# Altium schematic sheet NuPrism_MCPMT - ADC and Amplifier ADA4945-1 - Rev2.SchDoc: NuPrism Multichannel PMT - ADC and Amplifier ADA4945-1
size A; DrawnBy: D.Bishop; DocumentNumber: 9; Revision: 2; SheetNumber: 9; SheetTotal: 20
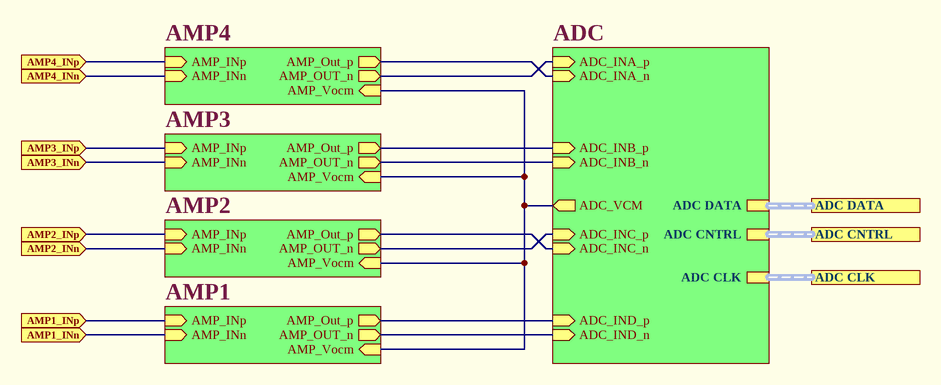
[diagram p0: NuPrism_MCPMT - ADC and Amplifier ADA4945-1 - Rev2.SchDoc]

## Sub-sheets
ADC = NuPrism_MCPMT - QUAD ADC - Rev2.SchDoc: ADC_INA_p (in), ADC_INA_n (in), ADC_INB_p (in), ADC_INB_n (in), ADC_INC_p (in), ADC_INC_n (in), ADC_IND_p (in), ADC_IND_n (in), ADC DATA (harness ADC DATA), ADC_VCM (out), ADC CNTRL (harness ADC CNTRL), ADC CLK (harness ADC CLK_SYSREF)
AMP1 = NuPrism_MCPMT - ADA4945-1 and Filter - Rev2.SchDoc: AMP_INp (in), AMP_INn (in), AMP_Out_p (out), AMP_OUT_n (out), AMP_Vocm (in)
AMP2 = NuPrism_MCPMT - ADA4945-1 and Filter - Rev2.SchDoc: AMP_INp (in), AMP_INn (in), AMP_Out_p (out), AMP_OUT_n (out), AMP_Vocm (in)
AMP3 = NuPrism_MCPMT - ADA4945-1 and Filter - Rev2.SchDoc: AMP_INp (in), AMP_INn (in), AMP_Out_p (out), AMP_OUT_n (out), AMP_Vocm (in)
AMP4 = NuPrism_MCPMT - ADA4945-1 and Filter - Rev2.SchDoc: AMP_INp (in), AMP_INn (in), AMP_Out_p (out), AMP_OUT_n (out), AMP_Vocm (in)

## Ports
ADC CLK (harness ADC CLK_SYSREF), ADC CNTRL (harness ADC CNTRL), ADC DATA (harness ADC DATA), AMP1_INn (in), AMP1_INp (in), AMP2_INn (in), AMP2_INp (in), AMP3_INn (in), AMP3_INp (in), AMP4_INn (in), AMP4_INp (in)

## Nets
AMP1_INn: port AMP1_INn, sheet AMP1/AMP_INn
AMP1_INp: port AMP1_INp, sheet AMP1/AMP_INp
AMP2_INn: port AMP2_INn, sheet AMP2/AMP_INn
AMP2_INp: port AMP2_INp, sheet AMP2/AMP_INp
AMP3_INn: port AMP3_INn, sheet AMP3/AMP_INn
AMP3_INp: port AMP3_INp, sheet AMP3/AMP_INp
AMP4_INn: port AMP4_INn, sheet AMP4/AMP_INn
AMP4_INp: port AMP4_INp, sheet AMP4/AMP_INp
(unnamed): sheet AMP1/AMP_Out_p, sheet ADC/ADC_IND_p
(unnamed): sheet AMP1/AMP_OUT_n, sheet ADC/ADC_IND_n
(unnamed): sheet AMP1/AMP_Vocm, sheet AMP2/AMP_Vocm, sheet AMP3/AMP_Vocm, sheet AMP4/AMP_Vocm, sheet ADC/ADC_VCM
(unnamed): sheet AMP2/AMP_Out_p, sheet ADC/ADC_INC_n
(unnamed): sheet AMP2/AMP_OUT_n, sheet ADC/ADC_INC_p
(unnamed): sheet AMP3/AMP_Out_p, sheet ADC/ADC_INB_p
(unnamed): sheet AMP3/AMP_OUT_n, sheet ADC/ADC_INB_n
(unnamed): sheet AMP4/AMP_Out_p, sheet ADC/ADC_INA_n
(unnamed): sheet AMP4/AMP_OUT_n, sheet ADC/ADC_INA_p

## Buses and harness runs
harness port ADC CLK = sheet ADC/ADC CLK
harness port ADC CNTRL = sheet ADC/ADC CNTRL
harness port ADC DATA = sheet ADC/ADC DATA

## Notes on the sheet
- Revision
- Sheet #:
- Drawing #:
- of
- Size:
- A
- TRIUMF
- 4004 Wesbrook Mall
- Vancouver, B.C.
- Canada
- File:
- Drawn by:
- Date:
- V6T 2A3